# Altium schematic sheet A06_LINKS_POWER.SchDoc: A06_LINKS_POWER
size 420 x 296 mm; Revision: A-SCH-AD-R2-NO-TP; SheetNumber: 6; SheetTotal: 7
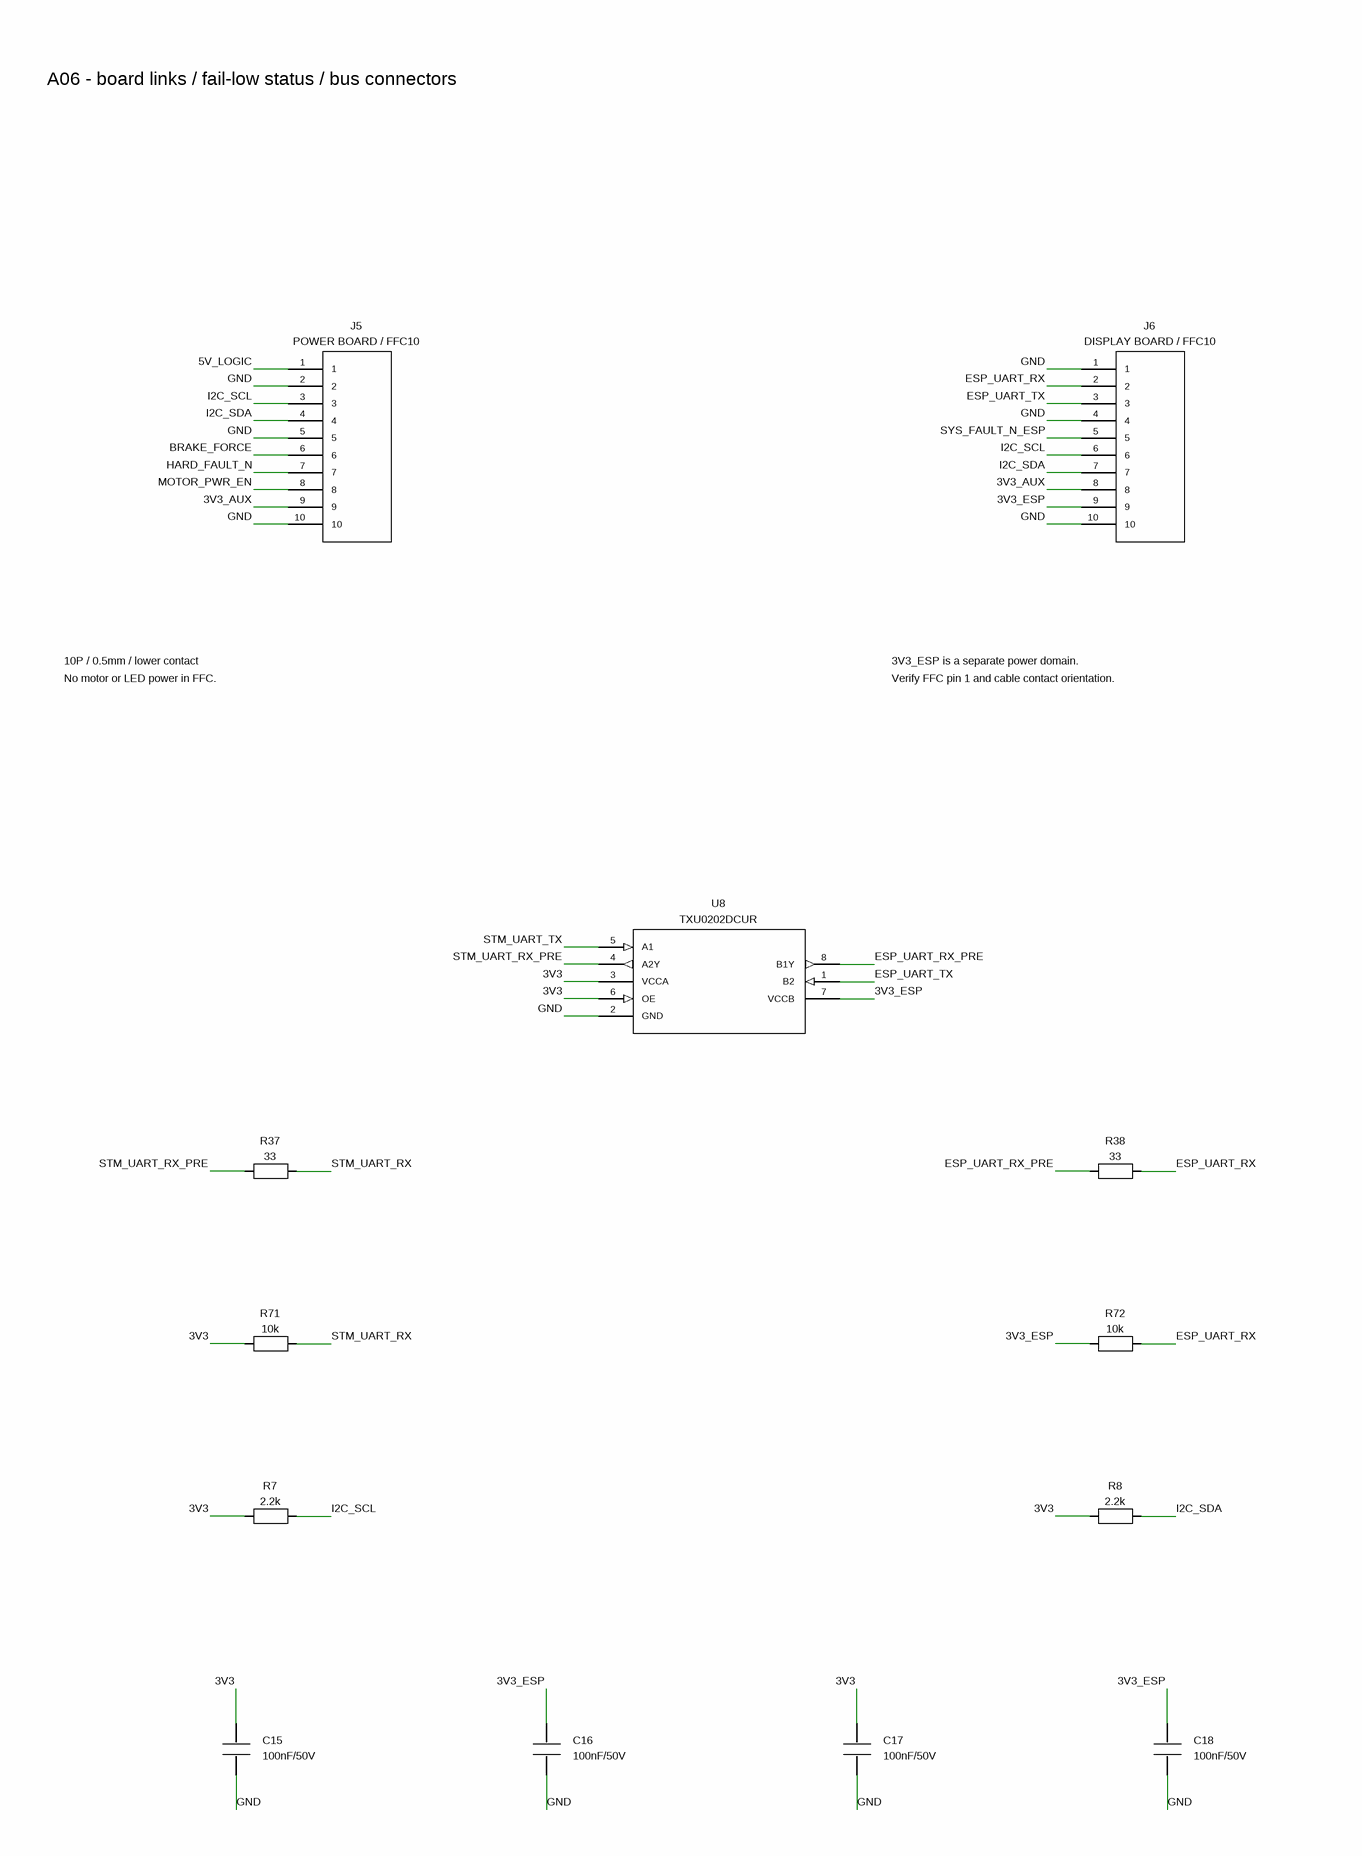
[diagram p0: A06_LINKS_POWER.SchDoc, left]
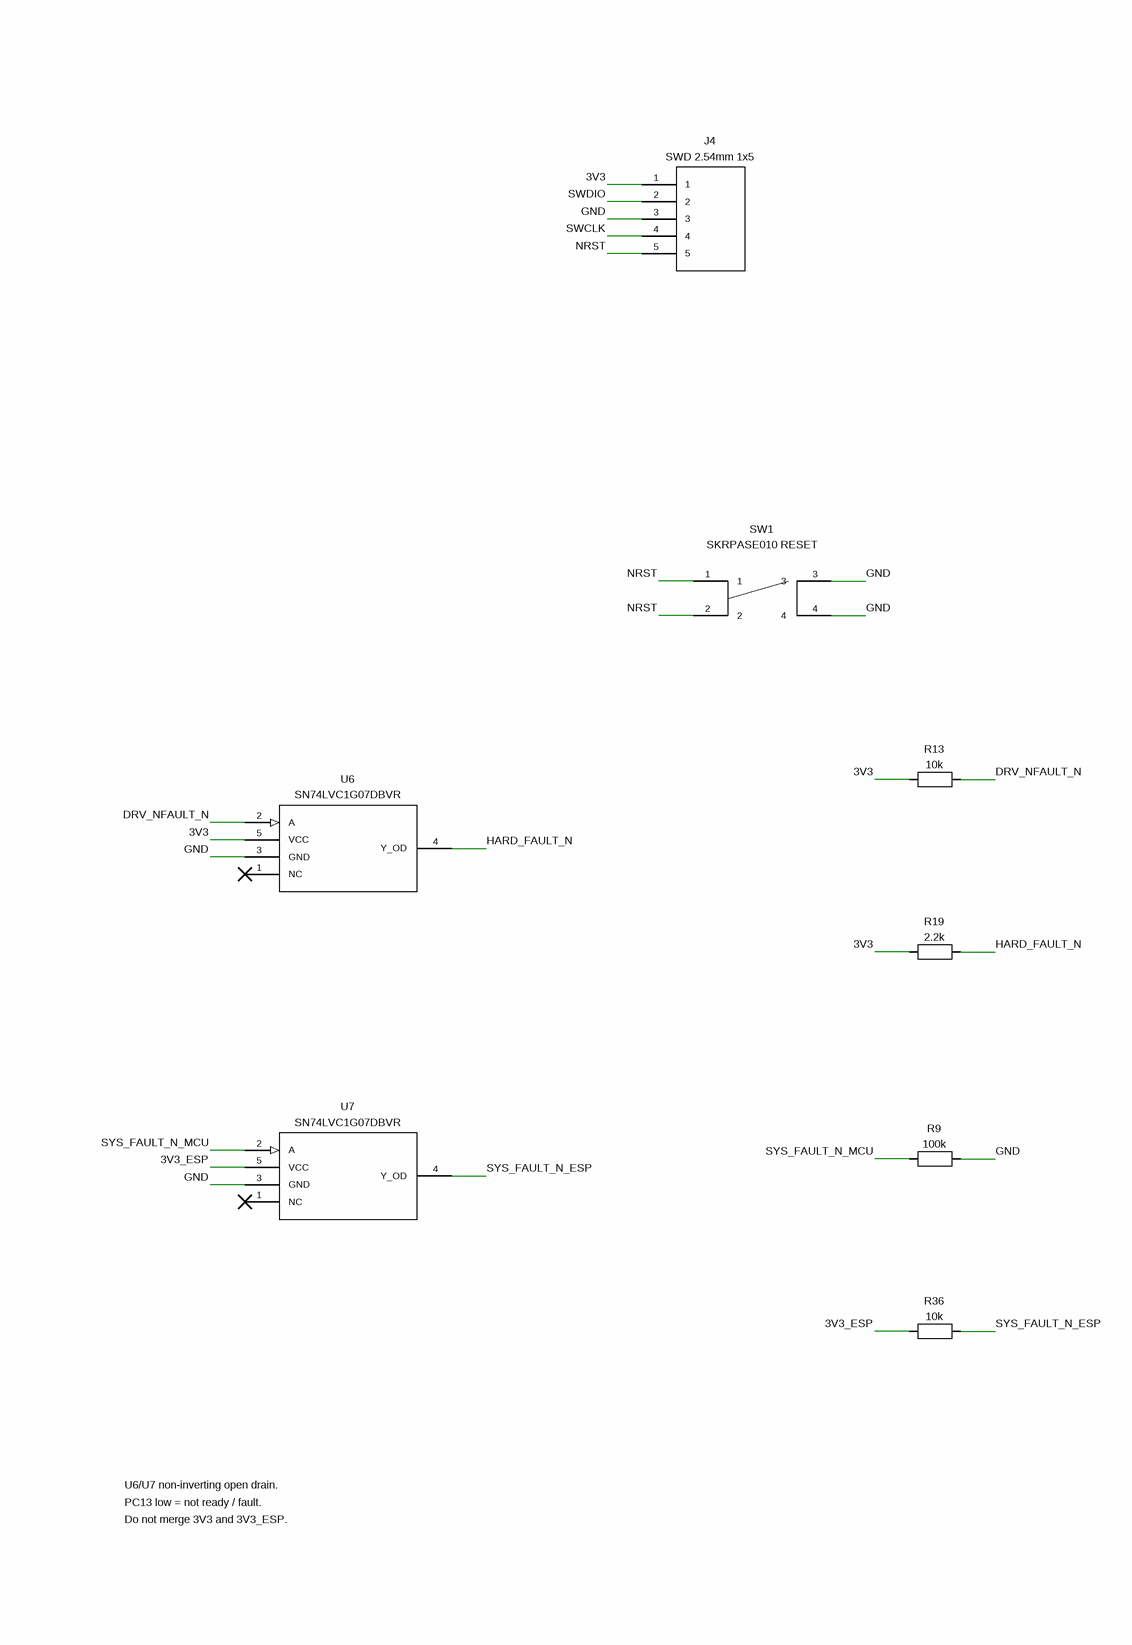
[diagram p1: A06_LINKS_POWER.SchDoc, right]

## Parts
C15  100nF/50V  [C0603_M]
C16  100nF/50V  [C0603_M]
C17  100nF/50V  [C0603_M]
C18  100nF/50V  [C0603_M]
J4  SWD 2.54mm 1x5  [GL30_HDR_1X05_P254_D102]
J5  POWER BOARD / FFC10  [FH1210S05SH55]
J6  DISPLAY BOARD / FFC10  [FH1210S05SH55]
R7  2.2k  [R0603_M]
R8  2.2k  [R0603_M]
R9  100k  [R0603_M]
R13  10k  [R0603_M]
R19  2.2k  [R0603_M]
R36  10k  [R0603_M]
R37  33  [R0603_M]
R38  33  [R0603_M]
R71  10k  [R0603_M]
R72  10k  [R0603_M]
SW1  SKRPASE010 RESET  [SKRPASE010]
U6  SN74LVC1G07DBVR  [SOT95P280X145-5N]
U7  SN74LVC1G07DBVR  [SOT95P280X145-5N]
U8  TXU0202DCUR  [SOP50P310X90-8N]

## Nets
3V3: C15.1 C17.1 J4.1 R7.1 R8.1 R13.1 R19.1 R71.1 U6.5(VCC) U8.3(VCCA) U8.6(OE)
3V3_AUX: J5.9 J6.8
3V3_ESP: C16.1 C18.1 J6.9 R36.1 R72.1 U7.5(VCC) U8.7(VCCB)
5V_LOGIC: J5.1
BRAKE_FORCE: J5.6
DRV_NFAULT_N: R13.2 U6.2(A)
ESP_UART_RX: J6.2 R38.2 R72.2
ESP_UART_RX_PRE: R38.1 U8.8(B1Y)
ESP_UART_TX: J6.3 U8.1(B2)
GND: C15.2 C16.2 C17.2 C18.2 J4.3 J5.2 J5.5 J5.10 J6.1 J6.4 J6.10 R9.2 SW1.3 SW1.4 U6.3(GND) U7.3(GND) U8.2(GND)
HARD_FAULT_N: J5.7 R19.2 U6.4(Y_OD)
I2C_SCL: J5.3 J6.6 R7.2
I2C_SDA: J5.4 J6.7 R8.2
MOTOR_PWR_EN: J5.8
NRST: J4.5 SW1.1 SW1.2
STM_UART_RX: R37.2 R71.2
STM_UART_RX_PRE: R37.1 U8.4(A2Y)
STM_UART_TX: U8.5(A1)
SWCLK: J4.4
SWDIO: J4.2
SYS_FAULT_N_ESP: J6.5 R36.2 U7.4(Y_OD)
SYS_FAULT_N_MCU: R9.1 U7.2(A)

Not connected (* = marked no-connect by the designer): U6 1(NC)*; U7 1(NC)*

## Notes on the sheet
- A06 - board links / fail-low status / bus connectors
- 10P / 0.5mm / lower contact
- 3V3_ESP is a separate power domain.
- No motor or LED power in FFC.
- Verify FFC pin 1 and cable contact orientation.
- U6/U7 non-inverting open drain.
- PC13 low = not ready / fault.
- Do not merge 3V3 and 3V3_ESP.

## Library data of the parts
C15 = C: 电容; MPN: CL10B104KB8NNNC; Source_KiCad_Footprint: GL30:C_0603_1608Metric; Specification: 100 nF / 50 V X7R; Design_note: U6; Assembly: FITTED; PCB_Model_Status: USER_LIBRARY_LINKED_PIN_NUMBERS_CHECKED; Package: 0603; Footprint_status: LIBRARY_SELECTED_PENDING_LAYOUT_REVIEW; Value: 100nF/50V
C16 = C: 电容; MPN: CL10B104KB8NNNC; Source_KiCad_Footprint: GL30:C_0603_1608Metric; Specification: 100 nF / 50 V X7R; Design_note: U7; Assembly: FITTED; PCB_Model_Status: USER_LIBRARY_LINKED_PIN_NUMBERS_CHECKED; Package: 0603; Footprint_status: LIBRARY_SELECTED_PENDING_LAYOUT_REVIEW; Value: 100nF/50V
C17 = C: 电容; MPN: CL10B104KB8NNNC; Source_KiCad_Footprint: GL30:C_0603_1608Metric; Specification: 100 nF / 50 V X7R; Design_note: U8.3; Assembly: FITTED; PCB_Model_Status: USER_LIBRARY_LINKED_PIN_NUMBERS_CHECKED; Package: 0603; Footprint_status: LIBRARY_SELECTED_PENDING_LAYOUT_REVIEW; Value: 100nF/50V
C18 = C: 电容; MPN: CL10B104KB8NNNC; Source_KiCad_Footprint: GL30:C_0603_1608Metric; Specification: 100 nF / 50 V X7R; Design_note: U8.7; Assembly: FITTED; PCB_Model_Status: USER_LIBRARY_LINKED_PIN_NUMBERS_CHECKED; Package: 0603; Footprint_status: LIBRARY_SELECTED_PENDING_LAYOUT_REVIEW; Value: 100nF/50V
J4 = Connector_5: SWD调试口; MPN: 通用单排排针 1×5P 2.54mm 直插; Design_note: 用户确认采用5P 2.54mm；1=VTREF(3V3), 2=SWDIO, 3=GND, 4=SWCLK, 5=NRST；VTREF仅供调试器感知目标电压，不作板供电输入; Assembly: FITTED; PCB_Model_Status: USER_LIBRARY_LINKED_PIN_NUMBERS_CHECKED; Package: THT 1×5，2.54mm；直插排针，0.64mm 方针; Specification: 通用单排排针 1×5P 2.54mm 直插; Footprint_status: REVIEWED_USER_LIBRARY_PROJECT_DERIVATIVE; Value: SWD 2.54mm 1x5
J5 = Connector_10: A↔B 电源板FFC; MPN: FH12-10S-0.5SH(55); Source_KiCad_Footprint: GL30:Hirose_FH12-10S-0.5SH_1x10-1MP_P0.50mm_Horizontal; Design_note: B板的充电/安全常开域独立供电；VM及主电流另走J1; Assembly: FITTED; PCB_Model_Status: USER_LIBRARY_LINKED_PIN_NUMBERS_CHECKED; Package: 10P 0.5mm SMT 下接触; Specification: FH12-10S-0.5SH(55); Footprint_status: LIBRARY_SELECTED_PENDING_LAYOUT_REVIEW; Value: POWER BOARD / FFC10
J6 = Connector_10: A↔C 屏幕与传感器FFC; MPN: FH12-10S-0.5SH(55); Source_KiCad_Footprint: GL30:Hirose_FH12-10S-0.5SH_1x10-1MP_P0.50mm_Horizontal; Design_note: 必须十线逐根导通核对；不是直接插屏幕12Pin；ESP自有5V/VSYS电源不经过此口; Assembly: FITTED; PCB_Model_Status: USER_LIBRARY_LINKED_PIN_NUMBERS_CHECKED; Package: 10P 0.5mm SMT 下接触; Specification: FH12-10S-0.5SH(55); Footprint_status: LIBRARY_SELECTED_PENDING_LAYOUT_REVIEW; Value: DISPLAY BOARD / FFC10
R7 R8 R19 = R: 电阻; MPN: 通用厚膜 2.2k 1% 0.1 W; Source_KiCad_Footprint: GL30:R_0603_1608Metric; Specification: 2.2k Ω；1%；0.1 W; Assembly: FITTED; PCB_Model_Status: USER_LIBRARY_LINKED_PIN_NUMBERS_CHECKED; Package: 0603; Footprint_status: LIBRARY_SELECTED_PENDING_LAYOUT_REVIEW; Value: 2.2k
R9 = R: 电阻; MPN: 通用厚膜 100k 1% 0.1 W; Source_KiCad_Footprint: GL30:R_0603_1608Metric; Specification: 100k Ω；1%；0.1 W; Assembly: FITTED; PCB_Model_Status: USER_LIBRARY_LINKED_PIN_NUMBERS_CHECKED; Package: 0603; Footprint_status: LIBRARY_SELECTED_PENDING_LAYOUT_REVIEW; Value: 100k
R13 = R: 电阻; MPN: 通用厚膜 10k 1% 0.1 W; Source_KiCad_Footprint: GL30:R_0603_1608Metric; Specification: 10k Ω；1%；0.1 W; Design_note: 独立上拉；逻辑5V/3V3先于VM上电; Assembly: FITTED; PCB_Model_Status: USER_LIBRARY_LINKED_PIN_NUMBERS_CHECKED; Package: 0603; Footprint_status: LIBRARY_SELECTED_PENDING_LAYOUT_REVIEW; Value: 10k
R36 = R: 电阻; MPN: 通用厚膜 10k 1% 0.1 W; Source_KiCad_Footprint: GL30:R_0603_1608Metric; Specification: 10k Ω；1%；0.1 W; Assembly: FITTED; PCB_Model_Status: USER_LIBRARY_LINKED_PIN_NUMBERS_CHECKED; Package: 0603; Footprint_status: LIBRARY_SELECTED_PENDING_LAYOUT_REVIEW; Value: 10k
R37 = R: 电阻; MPN: 通用厚膜 33 1% 0.1 W; Source_KiCad_Footprint: GL30:R_0603_1608Metric; Specification: 33 Ω；1%；0.1 W; Design_note: 放U8输出端; Assembly: FITTED; PCB_Model_Status: USER_LIBRARY_LINKED_PIN_NUMBERS_CHECKED; Package: 0603; Footprint_status: LIBRARY_SELECTED_PENDING_LAYOUT_REVIEW; Value: 33
R38 = R: 电阻; MPN: 通用厚膜 33 1% 0.1 W; Source_KiCad_Footprint: GL30:R_0603_1608Metric; Specification: 33 Ω；1%；0.1 W; Design_note: 放U8输出端，FFC到ESP RX; Assembly: FITTED; PCB_Model_Status: USER_LIBRARY_LINKED_PIN_NUMBERS_CHECKED; Package: 0603; Footprint_status: LIBRARY_SELECTED_PENDING_LAYOUT_REVIEW; Value: 33
R71 = R: 电阻; MPN: 通用厚膜 10k 1% 0.1 W; Source_KiCad_Footprint: GL30:R_0603_1608Metric; Specification: 10k Ω；1%；0.1 W; Design_note: U8掉电高阻时UART接收保持空闲高; Assembly: FITTED; PCB_Model_Status: USER_LIBRARY_LINKED_PIN_NUMBERS_CHECKED; Package: 0603; Footprint_status: LIBRARY_SELECTED_PENDING_LAYOUT_REVIEW; Value: 10k
R72 = R: 电阻; MPN: 通用厚膜 10k 1% 0.1 W; Source_KiCad_Footprint: GL30:R_0603_1608Metric; Specification: 10k Ω；1%；0.1 W; Design_note: STM掉电时ESP接收保持空闲高; Assembly: FITTED; PCB_Model_Status: USER_LIBRARY_LINKED_PIN_NUMBERS_CHECKED; Package: 0603; Footprint_status: LIBRARY_SELECTED_PENDING_LAYOUT_REVIEW; Value: 10k
SW1 = SKRPASE010: 复位按键; Specification: 常开瞬时; Design_note: 原厂编号1/2内部常连→NRST，3/4内部常连→GND；不改外壳按钮; Assembly: FITTED; PCB_Model_Status: USER_LIBRARY_LINKED_PIN_NUMBERS_CHECKED; MPN: SKRPASE010; Package: SMD 4.2×3.2×2.5 mm; Footprint_status: PENDING_PHYSICAL_FOOTPRINT_REVIEW; Value: SKRPASE010 RESET
U6 = SN74LVC1G07DBVR: DRV故障开漏缓冲; Source_KiCad_Footprint: GL30:SOT-23-5; Design_note: 防止比较器反拉DRV物理nFAULT; Assembly: FITTED; PCB_Model_Status: USER_LIBRARY_LINKED_PIN_NUMBERS_CHECKED; Datasheet: https://www.ti.com/lit/ds/symlink/sn74lvc1g07.pdf; MPN: SN74LVC1G07DBVR; Package: DBV SOT-23-5; Specification: SN74LVC1G07DBVR; Footprint_status: LIBRARY_SELECTED_PENDING_LAYOUT_REVIEW; Value: SN74LVC1G07DBVR
U7 = SN74LVC1G07DBVR: ESP故障开漏缓冲; Source_KiCad_Footprint: GL30:SOT-23-5; Design_note: 由ESP域供电；输入100k下拉；STM失电时报告故障; Assembly: FITTED; PCB_Model_Status: USER_LIBRARY_LINKED_PIN_NUMBERS_CHECKED; Datasheet: https://www.ti.com/lit/ds/symlink/sn74lvc1g07.pdf; MPN: SN74LVC1G07DBVR; Package: DBV SOT-23-5; Specification: SN74LVC1G07DBVR; Footprint_status: LIBRARY_SELECTED_PENDING_LAYOUT_REVIEW; Value: SN74LVC1G07DBVR
U8 = TXU0202DCUR: UART双电源接口; Source_KiCad_Footprint: GL30:VSSOP-8_2.3x2mm_P0.5mm; Design_note: 一发一收固定方向；不是TXB0102；OE接3V3; Assembly: FITTED; PCB_Model_Status: USER_LIBRARY_LINKED_PIN_NUMBERS_CHECKED; Datasheet: https://www.ti.com/lit/ds/symlink/txu0202.pdf; MPN: TXU0202DCUR; Package: DCU VSSOP8 2.3×2.0 mm; Specification: TXU0202DCUR; Footprint_status: LIBRARY_SELECTED_PENDING_LAYOUT_REVIEW; Value: TXU0202DCUR